# EAGLE design untitled (EAGLE 9.1.0)
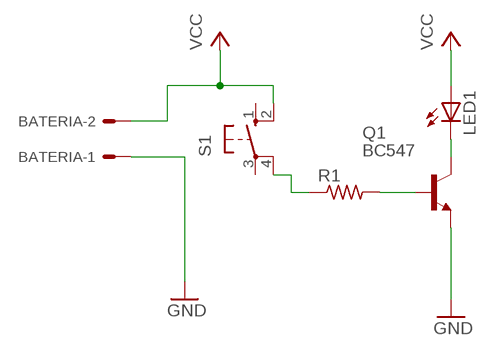
[diagram p0: schematic, sheet 1]

## Parts
BATERIA  KK-156-2  [KK-156-2]
LED1  LED5MM  [LED5MM]
Q1  BC547  [TO92]
R1  R-US_0207/7  [0207/7]
S1  10-XX  [B3F-10XX]

## Nets
GND: BATERIA.1 Q1.1(E)
N$1: Q1.2(B) R1.2
N$2: LED1.K(C) Q1.3(C)
N$3: R1.1 S1.4(P1)
VCC: BATERIA.2 LED1.A S1.2(S1)
Unconnected: S1.1(S) S1.3(P)

## Library data of the parts
BATERIA = con-molex:KK-156-2: KK 156 HEADER Source: http://www.molex.com/pdm_docs/sd/026604100_sd.pdf; MF: MOLEX; OC_FARNELL: unknown; OC_NEWARK: unknown
LED1 = led:LED: LED OSRAM: - CHIPLED LG R971, LG N971, LY N971, LG Q971, LY Q971, LO R971, LY R971 LH N974, LH R974 LS Q976, LO Q976, LY Q976 LO Q996 - Hyper CHIPLED LW Q18S LB Q993, LB Q99A, LB R99A - SideLED LS A670, LO A670, LY A670, LG A670, LP A670 LB A673, LV A673, LT A673, LW A673 LH A674 LY A675 LS A676, LA A676, LO A676, LY A676, LW A676 LS A679, LY A679, LG A679 - Hyper Micro SIDELED® LS Y876, LA Y876, LO Y876, LY Y876 LT Y87S - SmartLED LW L88C, LW L88S LB L89C, LB L89S, LG L890 LS L89K, LO L89K, LY L89K LS L896, LA L896, LO L896, LY L896 - TOPLED LS T670, LO T670, LY T670, LG T670, LP T670 LSG T670, LSP T670, LSY T670, LOP T670, LYG T670 LG T671, LOG T671, LSG T671 LB T673, LV T673, LT T673, LW T673 LH T674 LS T676, LA T676, LO T676, LY T676, LB T676, LH T676, LSB T676, LW T676 LB T67C, LV T67C, LT T67C, LS T67K, LO T67K, LY T67K, LW E67C LS E67B, LA E67B, LO E67B, LY E67B, LB E67C, LV E67C, LT E67C LW T67C LS T679, LY T679, LG T679 LS T770, LO T770, LY T770, LG T770, LP T770 LB T773, LV T773, LT T773, LW T773 LH T774 LS E675, LA E675, LY E675, LS T675 LS T776, LA T776, LO T776, LY T776, LB T776 LHGB T686 LT T68C, LB T68C - Hyper Mini TOPLED® LB M676 - Mini TOPLED Santana® LG M470 LS M47K, LO M47K, LY M47K Source: http://www.osram.convergy.de LUXEON: - LUMILED® LXK2-PW12-R00, LXK2-PW12-S00, LXK2-PW14-U00, LXK2-PW14-V00 LXK2-PM12-R00, LXK2-PM12-S00, LXK2-PM14-U00 LXK2-PE12-Q00, LXK2-PE12-R00, LXK2-PE12-S00, LXK2-PE14-T00, LXK2-PE14-U00 LXK2-PB12-K00, LXK2-PB12-L00, LXK2-PB12-M00, LXK2-PB14-N00, LXK2-PB14-P00, LXK2-PB14-Q00 LXK2-PR12-L00, LXK2-PR12-M00, LXK2-PR14-Q00, LXK2-PR14-R00 LXK2-PD12-Q00, LXK2-PD12-R00, LXK2-PD12-S00 LXK2-PH12-R00, LXK2-PH12-S00 LXK2-PL12-P00, LXK2-PL12-Q00, LXK2-PL12-R00 Source: www.luxeon.com KINGBRIGHT: KA-3528ASYC Source: www.kingbright.com
Q1 = transistor-npn:BC547*: NPN Transistor
R1 = resistor:R-US_: RESISTOR, American symbol
S1 = switch-omron:10-XX: OMRON SWITCH; MPN: B3F-1000; OC_FARNELL: 176432; OC_NEWARK: 36M3542

## Board
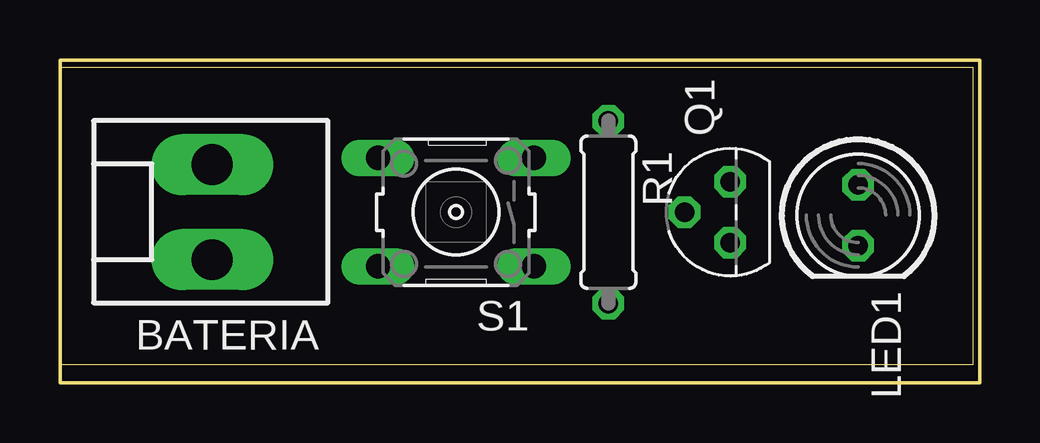
[diagram p1: board, top side]
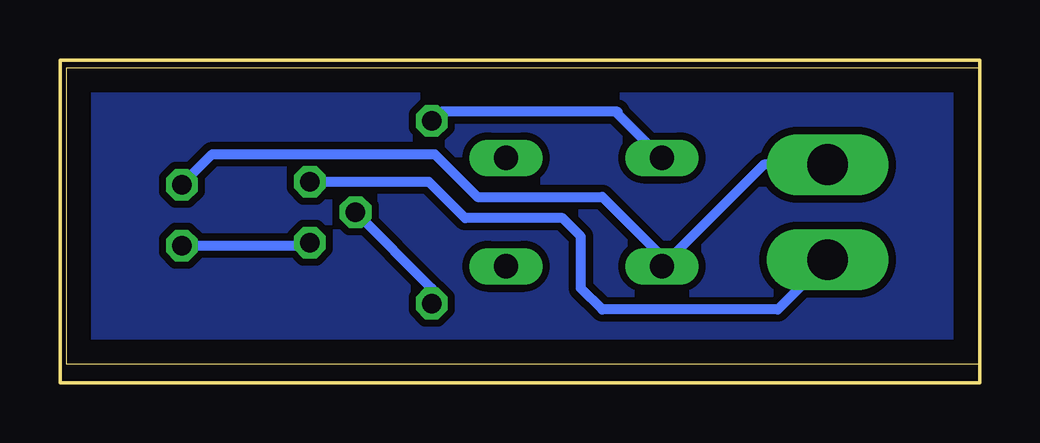
[diagram p2: board, bottom side, seen from below]

Size 38.35 x 13.46 mm. Coordinates in mm from the lower left corner, seen from the top.
Outline: 0,0.76 38.08,0.76 38.08,13.13 0,13.13 0,0.76
Outline: 0,13.46 38.35,13.46 38.35,0 0,0 0,13.46
Copper layers (1*16): Top 0.035mm / dielectric 1.5mm / Bottom 0.035mm
Design rules "default": minimum track width 6mil, minimum drill 0.35mm, track to track 6mil, track to pad 6mil, pad to pad 6mil, via to via 6mil, smd to smd 6mil, copper to edge 40mil, drill to drill 6mil, minimum pad ring 10mil, minimum via ring 8mil, stop-mask expansion 4mil, vias tented up to drill 0mil, thermal gap 10mil

### Footprints (pad centres in the part's own frame; a part is rotated, then mirrored left to right if it is on the bottom)
KK-156-2 = drill 1.7 pad 2.184 long: 1 -1.98,0; 2 1.98,0
LED5MM = drill 0.813 octagon: A -1.27,0; K 1.27,0
TO92 = drill 0.813 octagon: 1 1.27,0; 2 0,1.905; 3 -1.27,0
0207/7 = drill 0.813 octagon: 1 -3.81,0; 2 3.81,0
B3F-10XX = drill 1.016 long: 1 -3.251,2.261; 2 3.251,2.261; 3 -3.251,-2.261; 4 3.251,-2.261

### Placement (x,y rotation side)
BATERIA  6.35,7.11 90 top
LED1  33.27,6.98 270 top
Q1  27.94,7.11 90 top
R1  22.86,7.11 270 top
S1  16.51,7.11 180 top

### Tracks (layer width: path | path; a pad name or v marks a point on that pad's centre or on a via)
GND
  Bottom 0.406: Q1.1 22.99,8.38 21.46,6.86 17.4,6.86 16.64,6.1 16.64,3.94 15.75,3.05 8.43,3.05 BATERIA.1
N$1
  Bottom 0.406: Q1.2 22.86,3.94 R1.2
N$2
  Bottom 0.406: LED1.K 28.07,5.71 Q1.3
N$3
  Bottom 0.406: S1.4 15.11,11.23 15.11,11.3 22.48,11.3 R1.1
N$4
  pour Bottom (isolate 0.305): 0,0.76 0,13.08 0.13,13.08 38.23,13.08 38.23,0.64 0.13,0.64 0.13,0.76
VCC
  Bottom 0.406: BATERIA.2 9.02,9.09 S1.2 13.26,5.26 15.75,7.75 20.95,7.75 22.73,9.53 32,9.53 LED1.A